# EasyEDA Pro project flexTouch_v2.eprj

# Schematic Schematic1
Board Name: Board1; Create Date: 2025-05-26; Page Name: P1; Project Name: flexTouch_v2; Schematic Name: Schematic1; Update Date: 2025-05-25; Company: EasyEDA.com; Page Size: A4; Version: V1.0
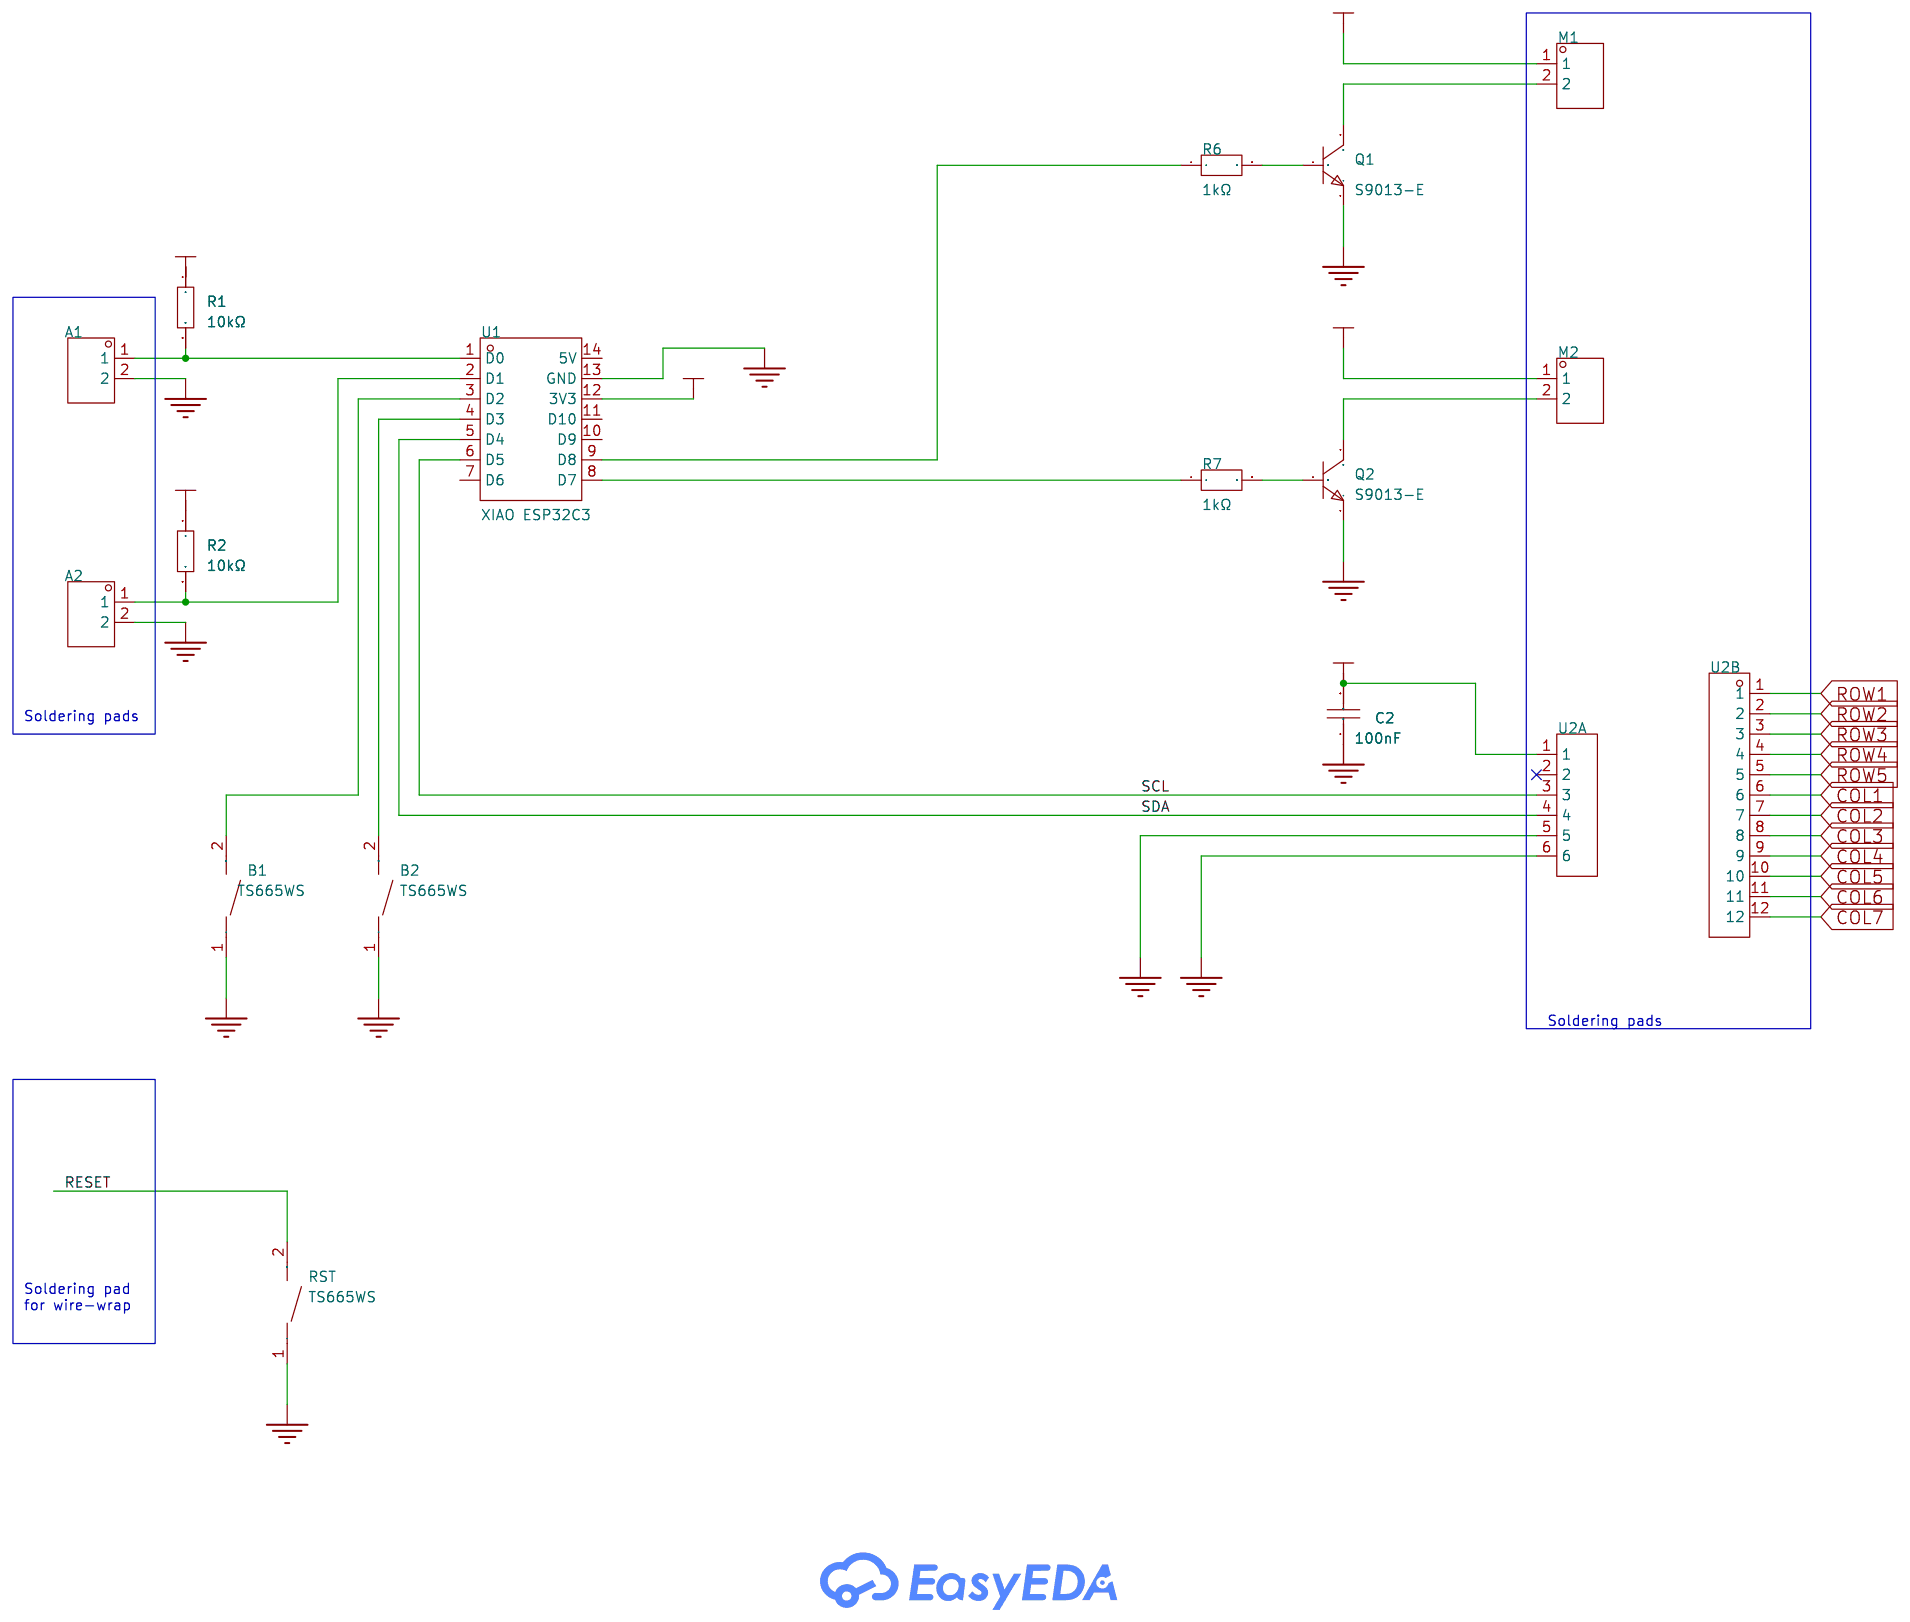
[diagram p0: schematic sheet]

## Parts
A1  B-2200S02P-A120  [HDR-TH_2P-P2.54-V-F]
A2  B-2200S02P-A120  [HDR-TH_2P-P2.54-V-F]
B1  TS665WS  [SW-SMD_L6.0-W6.0-LS6.6]
B2  TS665WS  [SW-SMD_L6.0-W6.0-LS6.6]
C2  100nF  [C0603]
M1  B-2200S02P-A120  [HDR-TH_2P-P2.54-V-F]
M2  B-2200S02P-A120  [HDR-TH_2P-P2.54-V-F]
Q1  S9013-E  [SOT-23-3_L2.9-W1.3-P1.90-LS2.4-BR]
Q2  S9013-E  [SOT-23-3_L2.9-W1.3-P1.90-LS2.4-BR]
R1  10kΩ  [R0603]
R2  10kΩ  [R0603]
R6  1kΩ  [R0603]
R7  1kΩ  [R0603]
RST  TS665WS  [SW-SMD_L6.0-W6.0-LS6.6]
U1  XIAO ESP32C3  [COMM-SMD_KQ-2801_V106]
U2A  2.54-1*6  [HDR-TH_6P-P2.54-V-M]
U2B  PM2.54-1*12  [HDR-TH_12P-P2.54-V-F]

## Library data of the parts
A1 A2 M1 M2 = B-2200S02P-A120: 插孔结构:1x2P;间距:2.54mm;行距:-;安装类型:直插;排数:单排;总孔位数:2P;塑高:-;触头材质:黄铜;触头镀层:-;; LCSC Part Name: 间距:2.54mm 1x2P 直插; Supplier Part: C124411; Manufacturer: Ckmtw(灿科盟); Supplier Footprint: 插件,P=2.54mm; JLCPCB Part Class: Extended Part; Datasheet: https://atta.szlcsc.com/upload/public/pdf/source/20170821/C124418_1503303326113901572.pdf; Supplier: LCSC; Holes Structure: 1x2P; Pitch: 2.54mm; Mounting Type: 直插; Number of Rows: 单排; Number of Holes: 2P; Contact Material: 黄铜
B1 B2 RST = TS665WS_C398058: Circuit:SPST Actuator Style:Round Button Operating Force:200gf Mounting Style:Brick nogging Switch Length:6mm Switch Width:6mm Switch Height:5mm Contact Current:50mA Voltage Rating (DC):12V With Lamp:- Mechanical Life:-; LCSC Part Name: 6*6*5mm 立贴 轻触开关; Supplier Part: C398058; Manufacturer: SHOU HAN(首韩); Supplier Footprint: SMD; JLCPCB Part Class: Extended Part; Datasheet: https://atta.szlcsc.com/upload/public/pdf/source/20190620/C398058_75EC11C2CCBC6DD113AE79D58CB25A40.pdf; Supplier: LCSC; Circuit: SPST; Actuator Style: Round Button; Operating Force: 200gf; Mounting Style: Brick nogging; Switch Length: 6mm; Switch Width: 6mm; Switch Height: 5mm; Contact Current: 50mA; Voltage Rating (DC): 12V
C2 = 0603B104K500NT_C30926: Capacitance:100nF Tolerance:±10% Tolerance:±10% Voltage Rating:50V Temperature Coefficient:X7R; LCSC Part Name: 100nF ±10% 50V; Supplier Part: C30926; Manufacturer: FH(风华); Manufacturer Part: 0603B104K500NT; Supplier Footprint: 0603; JLCPCB Part Class: Extended Part; Datasheet: https://atta.szlcsc.com/upload/public/pdf/source/20200305/C486355_26A10D38EF8C2A5C37091D0039909270.pdf; Supplier: LCSC; Tolerance: ±10%; Voltage Rating: 50V; Temperature Coefficient: X7R
Q1 Q2 = S9013-E: 晶体管类型:NPN;集电极电流(Ic):500mA;集射极击穿电压(Vceo):25V;耗散功率(Pd):300mW;直流电流增益(hFE):120@50mA,1V;; Supplier Part: C41371419; Manufacturer: MDD(辰达半导体); Supplier Footprint: SOT-23; JLCPCB Part Class: Extended Part; Datasheet: https://atta.szlcsc.com/upload/public/pdf/source/20241113/4DDBD2B8A7B6A974495B9B970C95E559.pdf; Supplier: LCSC; type: NPN; Current - Collector(Ic): 500mA; Collector - Emitter Voltage VCEO: 25V; Pd - Power Dissipation: 300mW; DC Current Gain: 120@50mA,1V; Transition frequency(fT): 150MHz; Current - Collector Cutoff: 100nA; Vce Saturation(VCE(sat)): 600mV; Operating Temperature: -55℃~+150℃
R1 R2 = RC0603FR-0710KL: Type:Thick Film Resistors Resistance: Tolerance:±1% Tolerance:±1% Power(Watts): Overload Voltage (Max): Temperature Coefficient:±100ppm/℃ Temperature Coefficient:±100ppm/℃ Operating Temperature Range:-55℃~+155℃ Operating Temperature Range:-55℃~+155℃; LCSC Part Name: 厚膜电阻 10kΩ ±1% 100mW; Supplier Part: C98220; Manufacturer: YAGEO(国巨); Supplier Footprint: 0603; JLCPCB Part Class: Extended Part; Datasheet: https://atta.szlcsc.com/upload/public/pdf/source/20180927/C295883_E8D83085EA81BD7DE0B2B681138C15EE.pdf; Supplier: LCSC; Type: Thick Film Resistors; Tolerance: ±1%; Temperature Coefficient: ±100ppm/℃; Operating Temperature Range: -55℃~+155℃
R6 R7 = SCR0603J1K: 电阻类型:厚膜电阻;阻值:1kΩ;精度:±5%;功率:100mW;最大工作电压:75V;; LCSC Part Name: 厚膜电阻 1kΩ ±5% 100mW; Supplier Part: C3017736; Manufacturer: VO(翔胜); Supplier Footprint: 0603; JLCPCB Part Class: Extended Part; Datasheet: https://atta.szlcsc.com/upload/public/pdf/source/20220513/247AF9639BA21CF93567DC289CCC6A22.pdf; Supplier: LCSC; Type: 厚膜电阻; Tolerance: ±5%; Power(Watts): 100mW; Overload Voltage (Max): 75V; Operating Temperature Range: -55℃~+155℃
U1 = XIAO ESP32C3: Supplier Part: C19189385; Supplier Footprint: QFN-32_5X5_EP3.7; JLCPCB Part Class: Extended Part; Supplier: LCSC
U2A = 2.54-1*6: Supplier Part: C5156615; Manufacturer: ZHOURI(洲日); Supplier Footprint: 插件,P=2.54mm; JLCPCB Part Class: Extended Part; Datasheet: https://atta.szlcsc.com/upload/public/pdf/source/20250227/F941FC765EF241ABFB2D5D72948A31A5.pdf; Supplier: LCSC; Pin Structure: 1x6P; Pitch: 2.54mm; Number of Rows: Single Row; Number of Pins: 6P
U2B = PM2.54-1*12: LCSC Part Name: 间距:2.54mm 1x12P 直插; Supplier Part: C5224029; Manufacturer: ZHOURI(洲日); Supplier Footprint: 插件,P=2.54mm; JLCPCB Part Class: Extended Part; Datasheet: https://atta.szlcsc.com/upload/public/pdf/source/20221031/8E1EDE7098C69E0E34EB4CABE01AB99F.pdf; Supplier: LCSC; Holes Structure: 1x12P; Pitch: 2.54mm; Row Spacing: 2.54mm; Circular Hole / Square Hole: 方孔; Mounting Type: Straight; Number of Rows: Plugin; Number of Holes: 12P; Current Rating (Max): 2.5A; Holes Direction: Top; Insulation Height: 8.5mm; Operating Temperature Range: -40℃~+105℃

## Nets
3V3: C2.2 M1.1 M2.1 R1.1 R2.1 U1.12(3V3) U2A.1
GND: A1.2 A2.2 B1.1(A) B2.1(A) C2.1 Q1.2(E) Q2.2(E) RST.1(A) U1.13(GND) U2A.5 U2A.6
COL1: U2B.6
COL2: U2B.7
COL3: U2B.8
COL4: U2B.9
COL5: U2B.10
COL6: U2B.11
COL7: U2B.12
RESET: RST.2(B)
ROW1: U2B.1
ROW2: U2B.2
ROW3: U2B.3
ROW4: U2B.4
ROW5: U2B.5
SCL: U1.6(D5) U2A.3
SDA: U1.5(D4) U2A.4
$1N1297: M1.2 Q1.3(C)
$1N1300: Q1.1(B) R6.2
$1N1301: R6.1 U1.9(D8)
$1N1303: M2.2 Q2.3(C)
$1N1306: Q2.1(B) R7.2
$1N1307: R7.1 U1.8(D7)
$1N1322: A1.1 R1.2 U1.1(D0)
$1N1324: A2.1 R2.2 U1.2(D1)
$1N1326: B1.2(B) U1.3(D2)
$1N1327: B2.2(B) U1.4(D3)

Not connected (* = marked no-connect by the designer): U1 7(D6) 10(D9) 11(D10) 14(5V); U2A 2*

## Notes on the sheet
- Soldering pads
- Soldering pads
- Soldering pad
  for wire-wrap

# Board PCB1
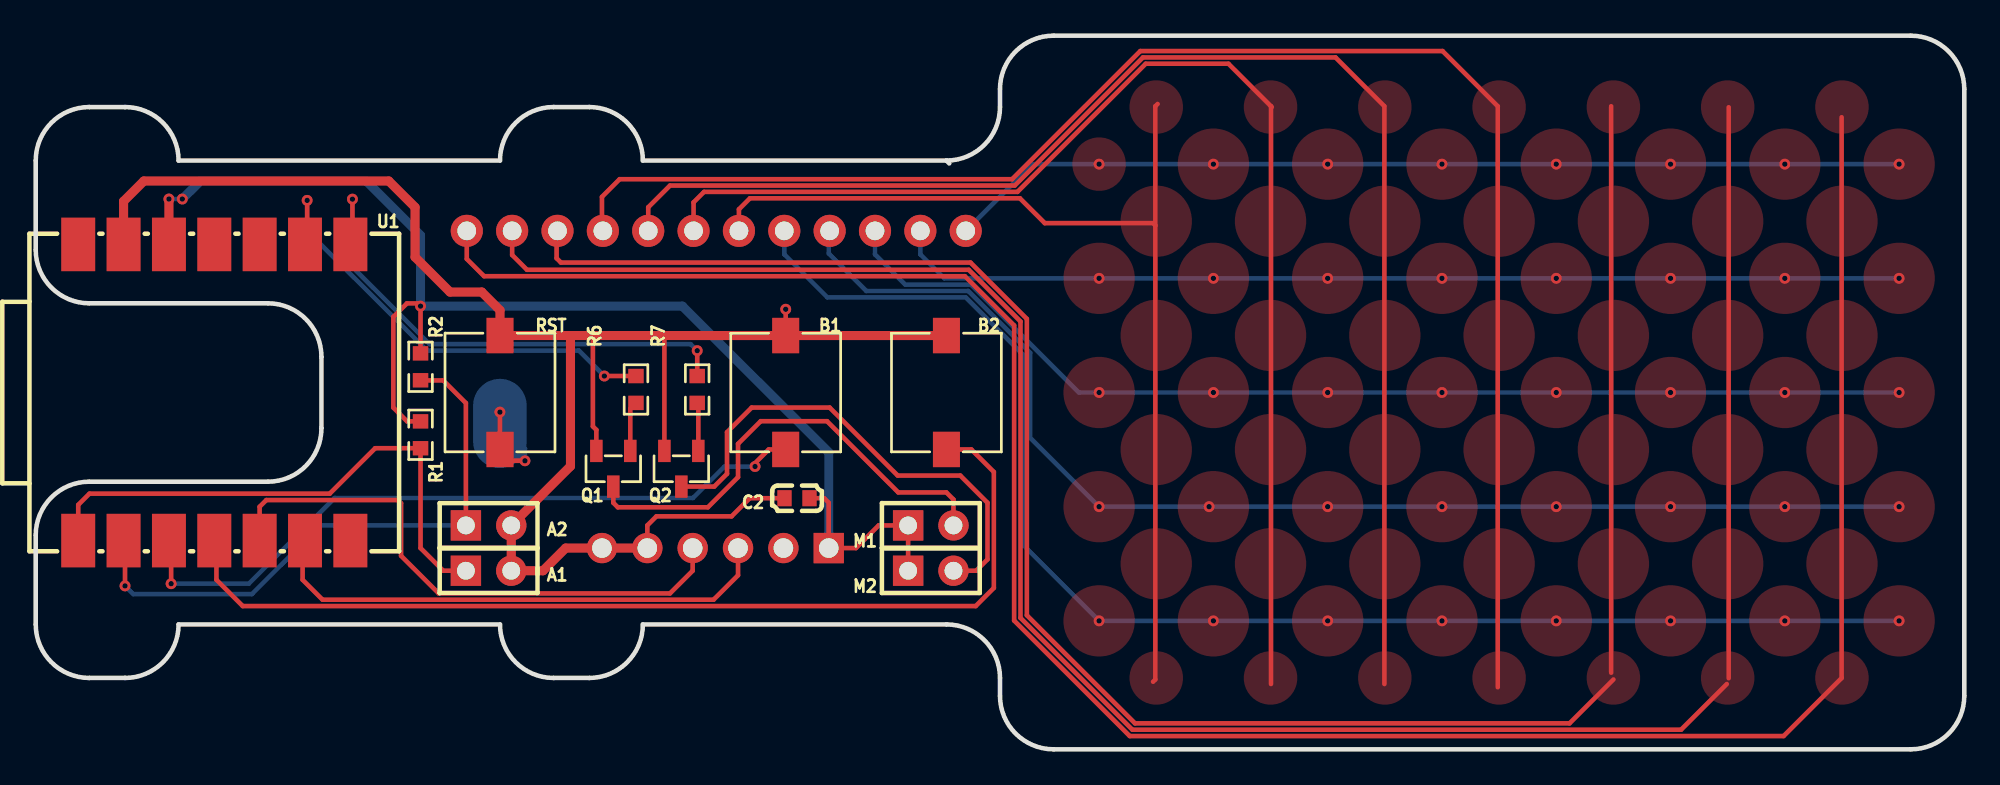
[diagram p1: board, top side]
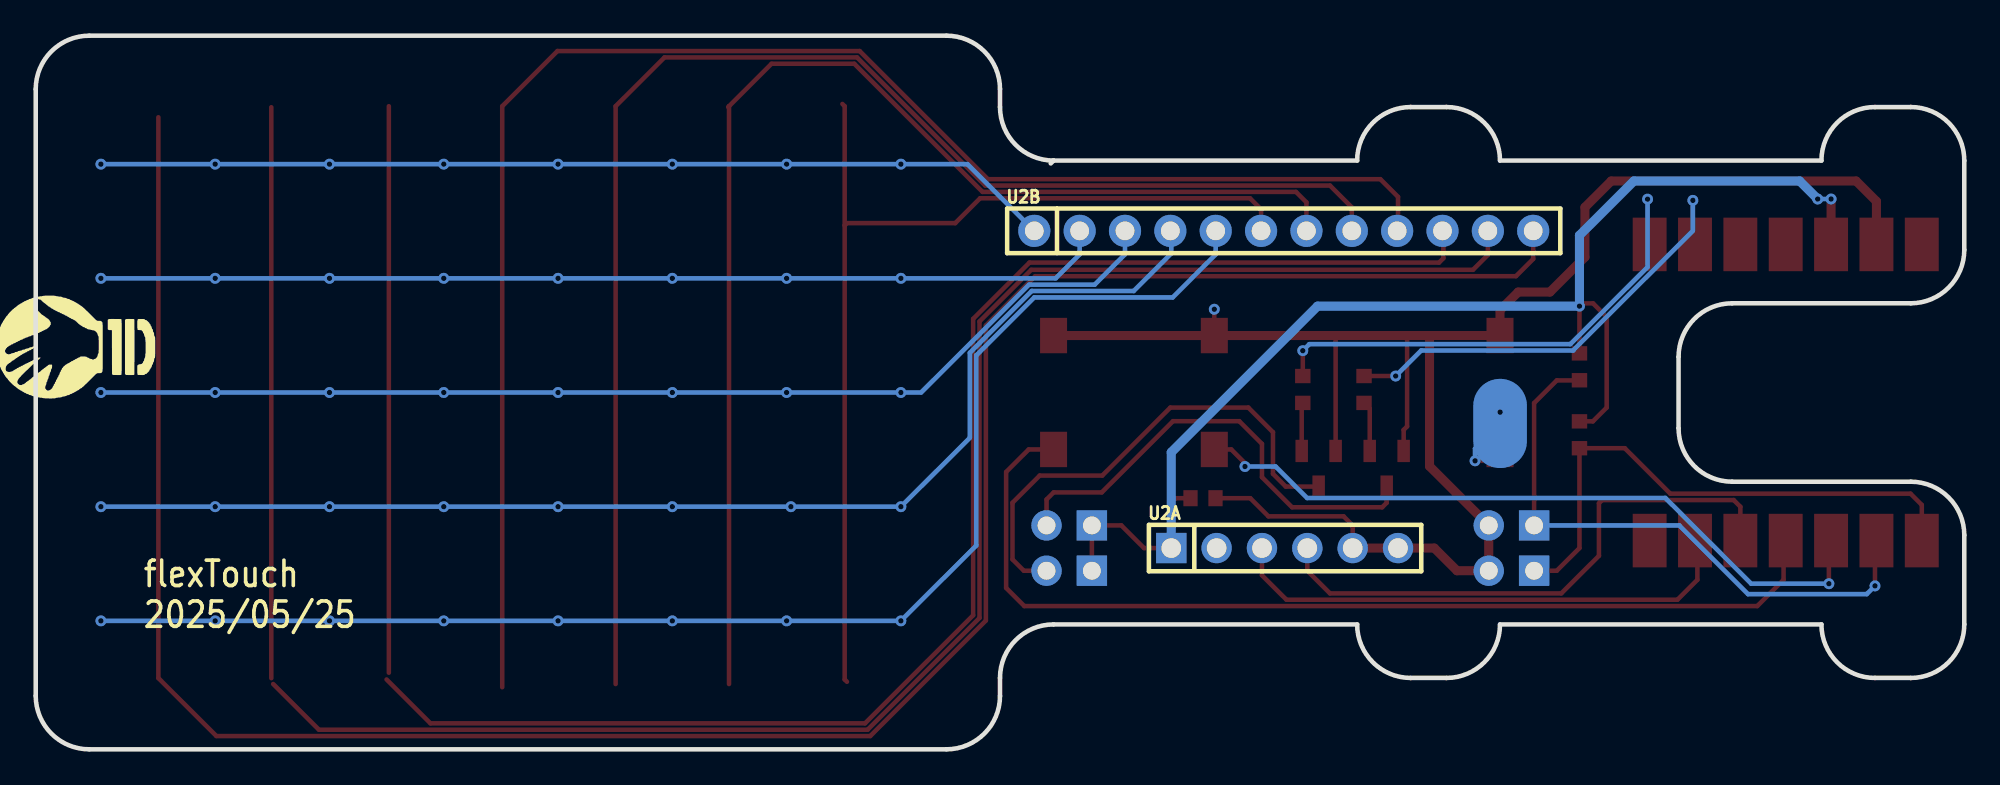
[diagram p2: board, bottom side, seen from below]

Outline 108 x 40 mm; copper layers: Top Layer, Bottom Layer. Coordinates in mm from the lower left corner of the outline.
Outline path: 51,33 34,33 arc(33.12,35.12) 31,36 29,36 arc(26.88,35.12) 26,33 8,33 arc(7.12,35.12) 5,36 3,36 arc(0.88,35.12) 0,33 0,28 arc(0.88,25.88) 3,25 13,25 arc(15.12,24.12) 16,22 16,18 arc(15.12,15.88) 13,15 3,15 arc(0.88,14.12) 0,12 0,7 arc(0.88,4.88) 3,4 5,4 arc(7.12,4.88) 8,7 26,7 arc(26.88,4.88) 29,4 31,4 arc(33.12,4.88) 34,7 51,7 arc(53.12,6.12) 54,4 54,3 arc(54.88,0.88) 57,0 105,0 arc(107.12,0.88) 108,3 108,37 arc(107.12,39.12) 105,40 57,40 arc(54.88,39.12) 54,37 54,36 arc(53.12,33.88) 51,33 ; 51,33 51.16,32.84
Stack: Top Layer 0.035mm / Dielectric1 1.51mm FR4 er 4.5 / Bottom Layer 0.035mm

## Design rules (mm)
template: JLCPCB Capability(Two Layers Board)
spacing copperThickness1oz (default): track to track 0.102, other pairs 0.152 to 0.3
spacing copperThickness2oz: track to track 0.203, other pairs 0.152 to 0.3
track width copperThickness1oz (default): min 0.127, default 0.254, max 2.54
track width copperThickness2oz: min 0.203, default 0.254, max 2.54
differential pair differentialPair (default): width min 0.127, default 0.254, max 2.54; gap min 0.152, default 0.152
via viaSize (default): diameter min 0.5, default 0.61, max 10; hole min 0.3, default 0.305, max 6.3

## Placement (name value [footprint] x y rotation side)
A1  B-2200S02P-A120  [HDR-TH_2P-P2.54-V-F]  25.36 10.01 0 top
A2  B-2200S02P-A120  [HDR-TH_2P-P2.54-V-F]  25.36 12.55 0 top
B1  TS665WS  [SW-SMD_L6.0-W6.0-LS6.6]  42 20 270 top
B2  TS665WS  [SW-SMD_L6.0-W6.0-LS6.6]  51 20 270 top
C2  100nF  [C0603]  42.63 14.07 0 top
M1  B-2200S02P-A120  [HDR-TH_2P-P2.54-V-F]  50.12 12.55 0 top
M2  B-2200S02P-A120  [HDR-TH_2P-P2.54-V-F]  50.12 10.01 0 top
NOREF  -  [Pad_e752]  26 18.27 0 top
Q1  S9013-E  [SOT-23-3_L2.9-W1.3-P1.90-LS2.4-BR]  32.34 15.72 90 top
Q2  S9013-E  [SOT-23-3_L2.9-W1.3-P1.90-LS2.4-BR]  36.16 15.72 90 top
R1  10kΩ  [R0603]  21.55 17.63 270 top
R2  10kΩ  [R0603]  21.55 21.44 270 top
R6  1kΩ  [R0603]  33.61 20.17 270 top
R7  1kΩ  [R0603]  37.04 20.17 270 top
RST  TS665WS  [SW-SMD_L6.0-W6.0-LS6.6]  26 20 270 top
U1  XIAO ESP32C3  [COMM-SMD_KQ-2801_V106]  10 20 0 top
U2A  2.54-1*6  [HDR-TH_6P-P2.54-V-M]  38.06 11.28 180 bottom
U2B  PM2.54-1*12  [HDR-TH_12P-P2.54-V-F]  38.11 29.06 180 bottom

## Footprints (pads in the part's own frame, mm; a bottom-side part is the same pattern mirrored in y, then rotated)
C0603
  rect 0.8x0.9 smd: 1(-0.7,0) 2(0.7,0)
COMM-SMD_KQ-2801_V106
  rect 1.9x3 smd: 1(-7.62,-8.3) 2(-5.08,-8.3) 3(-2.54,-8.3) 4(0,-8.3) 5(2.54,-8.3) 6(5.08,-8.3) 7(7.62,-8.3) 8(7.62,8.3) 9(5.08,8.3) 10(2.54,8.3) 11(0,8.3) 12(-2.54,8.3) 13(-5.08,8.3) 14(-7.62,8.3)
HDR-TH_2P-P2.54-V-F
  rect 1.7x1.7 hole 1: 1(-1.27,0)
  round 1.7 hole 1: 2(1.27,0)
HDR-TH_6P-P2.54-V-M
  rect 1.7x1.7 hole 1.1: 1(-6.35,0)
  round 1.7 hole 1.1: 2(-3.81,0) 3(-1.27,0) 4(1.27,0) 5(3.81,0) 6(6.35,0)
HDR-TH_12P-P2.54-V-F
  round 1.8 hole 1.05: 1(-13.97,0) 2(-11.43,0) 3(-8.89,0) 4(-6.35,0) 5(-3.81,0) 6(-1.27,0) 7(1.27,0) 8(3.81,0) 9(6.35,0) 10(8.89,0) 11(11.43,0) 12(13.97,0)
Pad_e752
  oval 3x5 smd far side: 1(0,0)
R0603
  rect 0.806x0.864 smd: 1(-0.753,0) 2(0.753,0)
SOT-23-3_L2.9-W1.3-P1.90-LS2.4-BR
  rect 1.25x0.7 smd: 1(1,-0.95) 2(1,0.95) 3(-1,0)
SW-SMD_L6.0-W6.0-LS6.6
  rect 1.985x1.512 smd: 1(-3.192,0) 2(3.192,0)

## Nets
As in the schematic, except:
RESET: NOREF.1 RST.2

Pads without a net: U1 7 10 11 14; U2A 2

## Via types
v1: diameter 0.61, hole 0.305, Top Layer to Bottom Layer, 53 vias

## Routing (per net, layer and track width the routed paths; a pad name or vN(x,y) marks a point on that pad's centre or on a via; arc(x,y) is an arc through that point)
3V3: length 76.6
  Top Layer w0.254: R1.1 20.8,18.38 20.03,19.15 20.03,24.23 20.79,25 21.4,25 v1(21.55,24.84) R2.1 ; M2.1 M1.1 47.2,12.55 45.93,11.28 U2A.1 44.41,13.82 44.16,14.07 C2.2
  Top Layer w0.508: U1.12 v1(7.46,30.84)
  Bottom Layer w0.254: v1(8.21,30.84) v1(7.46,30.84)
  Bottom Layer w0.508: v1(8.21,30.84) 9.22,31.85 18.5,31.85 21.55,28.81 v1(21.55,24.84) 36.21,24.84 44.41,16.64 U2A.1
GND: length 101.8
  Top Layer w0.254: 31.2,23.19 31.2,18.1 31.39,17.91 Q1.2 ; Q2.2 35.2,23.19 ; v1(42,24.67) B1.1 ; C2.1 39.98,14.07 38.97,13.06 34.76,13.06 34.25,12.55 U2A.5
  Top Layer w0.508: U1.13 4.92,30.72 6.06,31.85 19.77,31.85 21.24,30.38 21.24,27.59 23.2,25.63 24.98,25.63 26,24.61 RST.1 29.95,23.19 ; U2A.5 U2A.6 29.68,11.28 28.41,10.01 A1.2 A2.2 29.95,15.87 29.95,23.19 ; 29.95,23.19 B1.1 B2.1
COL1: length 57.9
  Top Layer w0.254: U2B.6 39.38,30.27 40,30.89 55.11,30.89 56.51,29.49 62.57,29.49 62.7,29.36 ; 62.7,29.36 62.7,3.91 62.57,3.79 ; 62.7,29.36 62.7,36.05 62.82,36.17
COL2: length 70.6
  Top Layer w0.254: 69.18,36.05 66.79,38.43 62.16,38.43 54.98,31.24 37.43,31.24 36.84,30.66 U2B.7 ; 69.18,36.05 69.22,36 ; 69.18,36.05 69.18,3.66
COL3: length 79.5
  Top Layer w0.254: U2B.8 34.3,30.38 35.52,31.6 54.82,31.6 62.01,38.78 72.79,38.78 75.53,36.05 75.53,3.66
COL4: length 89.3
  Top Layer w0.254: 81.88,3.48 81.88,36.05 78.78,39.14 61.86,39.14 54.68,31.96 32.7,31.96 31.71,30.97 31.71,29.11 U2B.9
COL5: length 114
  Top Layer w0.254: U2B.10 29.17,29.01 29.17,27.53 29.41,27.28 52.35,27.28 55.5,24.13 55.5,7.51 61.56,1.46 85.89,1.46 88.35,3.91 ; 88.22,36.05 88.22,4.3
COL6: length 123.2
  Top Layer w0.254: 94.81,35.99 94.81,3.99 ; U2B.11 26.68,27.71 27.51,26.88 52.25,26.88 55.15,23.98 55.15,7.36 61.41,1.1 92.14,1.1 94.7,3.66
COL7: length 132.1
  Top Layer w0.254: 101.13,35.43 101.13,3.99 97.88,0.74 61.27,0.74 54.79,7.22 54.79,23.76 52.03,26.52 25.11,26.52 24.14,27.49 U2B.12
RESET: length 6.4
  Top Layer w0.254: v1(27.4,16.17) 26.64,16.17 RST.2 26,16.81 v1(26,18.9)
  Bottom Layer w0.254: NOREF.1 27.4,16.86 v1(27.4,16.17)
ROW1: length 53.8
  Bottom Layer w0.254: v1(104.35,32.8) v1(97.95,32.8) v1(91.55,32.8) v1(85.15,32.8) v1(78.75,32.8) v1(72.35,32.8) v1(65.95,32.8) v1(59.55,32.8) 55.82,32.8 U2B.1
ROW2: length 56.7
  Bottom Layer w0.254: U2B.2 49.54,27.74 50.88,26.4 v1(59.55,26.4) v1(65.95,26.4) v1(72.35,26.4) v1(78.75,26.4) v1(85.15,26.4) v1(91.55,26.4) v1(97.95,26.4) v1(104.35,26.4)
ROW3: length 61.9
  Bottom Layer w0.254: U2B.3 47,27.74 48.7,26.04 52.37,26.04 58.42,20 v1(59.55,20) v1(65.95,20) v1(72.35,20) v1(78.75,20) v1(85.15,20) v1(91.55,20) v1(97.95,20) v1(104.35,20)
ROW4: length 69.9
  Bottom Layer w0.254: v1(104.35,13.6) v1(97.95,13.6) v1(91.55,13.6) v1(85.15,13.6) v1(78.75,13.6) v1(72.35,13.6) v1(65.71,13.6) v1(59.55,13.6) 55.69,17.46 55.69,22.23 52.23,25.69 46.51,25.69 44.41,27.79 44.41,29.01 U2B.4
ROW5: length 78.5
  Bottom Layer w0.254: U2B.5 41.92,27.74 44.33,25.33 52.08,25.33 55.33,22.08 55.33,11.42 v1(59.55,7.2) v1(65.95,7.2) v1(72.35,7.2) v1(78.75,7.2) v1(85.15,7.2) v1(91.55,7.2) v1(97.95,7.2) v1(104.35,7.2)
SCL: length 29.2
  Top Layer w0.254: U2A.3 39.33,9.76 37.96,8.38 16.06,8.38 14.95,9.5 14.95,11.57 U1.6
SDA: length 32
  Top Layer w0.254: U2A.4 36.79,10.01 35.52,8.74 22.57,8.74 20.46,10.85 20.46,13.79 20.28,13.97 12.91,13.97 12.54,13.6 U1.5
$1N1297: length 26.4
  Top Layer w0.254: M1.2 51.4,14 50.99,14.4 48.3,14.4 44.31,18.39 40.6,18.39 39.33,17.12 39.33,15.25 37.64,13.57 32.6,13.57 32.34,13.82 Q1.3
$1N1300: length 2.8
  Top Layer w0.254: R6.2 33.3,19.1 Q1.1
$1N1301: length 26
  Top Layer w0.254: U1.9 15.2,28.42 v1(15.2,30.77) ; v1(31.84,20.92) R6.1
  Bottom Layer w0.254: v1(15.2,30.77) 15.2,29.06 21.91,22.35 30.41,22.35 v1(31.84,20.92)
$1N1303: length 27.9
  Top Layer w0.254: Q2.3 38,14.72 38.71,15.44 38.71,17.78 40.09,19.15 44.46,19.15 48.27,15.34 51.78,15.34 53.3,13.82 53.3,10.64 52.66,10.01 M2.2
$1N1306: length 2.8
  Top Layer w0.254: Q2.1 37.1,19.1 36.79,19.42
$1N1307: length 28.8
  Top Layer w0.254: U1.8 17.74,28.42 v1(17.74,30.84) ; 37.04,21.18 v1(37.04,22.34)
  Bottom Layer w0.254: v1(37.04,22.34) 36.68,22.71 22.06,22.71 17.74,27.03 v1(17.74,30.84)
$1N1322: length 31.1
  Top Layer w0.254: A1.1 22.82,10.01 21.55,11.28 R1.2 19.01,16.88 16.46,14.33 3.01,14.33 2.38,13.7 U1.1
$1N1324: length 34.5
  Top Layer w0.254: v1(5,9.16) 5,12.17 4.92,12.25 U1.2 ; A2.1 24.09,19.41 22.82,20.68 21.56,20.68 R2.2
  Bottom Layer w0.254: v1(5,9.16) 5.46,8.7 12.11,8.7 15.96,12.55 A2.1
$1N1326: length 41.1
  Top Layer w0.254: B1.2 41.05,16.81 40.28,16.04 v1(40.28,15.85) ; v1(7.58,9.28) 7.58,12.08 7.46,12.2 U1.3
  Bottom Layer w0.254: v1(7.58,9.28) 11.93,9.28 16.74,14.09 36.8,14.09 38.57,15.85 v1(40.28,15.85)
$1N1327: length 56.6
  Top Layer w0.254: U1.4 10.12,11.58 10.12,9.5 11.59,8.03 52.64,8.03 53.66,9.05 53.66,15.55 52.39,16.81 B2.2 50.85,16.81

## Copper pours and planes (outline as drawn; the poured copper is in the pictures)
COL1 on Top Layer: 61.25,5.5 64.25,5.5 64.25,2.5 61.25,2.5
COL1 on Top Layer: 60.75,31.6 64.75,31.6 64.75,27.6 60.75,27.6
COL1 on Top Layer: 60.75,18.8 64.75,18.8 64.75,14.8 60.75,14.8
COL1 on Top Layer: 60.75,12.4 64.75,12.4 64.75,8.4 60.75,8.4
COL1 on Top Layer: 60.75,25.2 64.75,25.2 64.75,21.2 60.75,21.2
COL1 on Top Layer: 61.25,37.5 64.25,37.5 64.25,34.5 61.25,34.5
COL2 on Top Layer: 67.15,25.2 71.15,25.2 71.15,21.2 67.15,21.2
COL2 on Top Layer: 67.65,37.5 70.65,37.5 70.65,34.5 67.65,34.5
COL2 on Top Layer: 67.15,12.4 71.15,12.4 71.15,8.4 67.15,8.4
COL2 on Top Layer: 67.15,18.8 71.15,18.8 71.15,14.8 67.15,14.8
COL2 on Top Layer: 67.65,5.5 70.65,5.5 70.65,2.5 67.65,2.5
COL2 on Top Layer: 67.15,31.6 71.15,31.6 71.15,27.6 67.15,27.6
COL3 on Top Layer: 73.55,31.6 77.55,31.6 77.55,27.6 73.55,27.6
COL3 on Top Layer: 73.55,12.4 77.55,12.4 77.55,8.4 73.55,8.4
COL3 on Top Layer: 73.55,25.2 77.55,25.2 77.55,21.2 73.55,21.2
COL3 on Top Layer: 73.55,18.8 77.55,18.8 77.55,14.8 73.55,14.8
COL3 on Top Layer: 74.05,37.5 77.05,37.5 77.05,34.5 74.05,34.5
COL3 on Top Layer: 74.05,5.5 77.05,5.5 77.05,2.5 74.05,2.5
COL4 on Top Layer: 80.45,37.5 83.45,37.5 83.45,34.5 80.45,34.5
COL4 on Top Layer: 79.95,25.2 83.95,25.2 83.95,21.2 79.95,21.2
COL4 on Top Layer: 79.95,31.6 83.95,31.6 83.95,27.6 79.95,27.6
COL4 on Top Layer: 79.95,18.8 83.95,18.8 83.95,14.8 79.95,14.8
COL4 on Top Layer: 80.45,5.5 83.45,5.5 83.45,2.5 80.45,2.5
COL4 on Top Layer: 79.95,12.4 83.95,12.4 83.95,8.4 79.95,8.4
COL5 on Top Layer: 86.35,31.6 90.35,31.6 90.35,27.6 86.35,27.6
COL5 on Top Layer: 86.35,12.4 90.35,12.4 90.35,8.4 86.35,8.4
COL5 on Top Layer: 86.35,25.2 90.35,25.2 90.35,21.2 86.35,21.2
COL5 on Top Layer: 86.85,5.5 89.85,5.5 89.85,2.5 86.85,2.5
COL5 on Top Layer: 86.85,37.5 89.85,37.5 89.85,34.5 86.85,34.5
COL5 on Top Layer: 86.35,18.8 90.35,18.8 90.35,14.8 86.35,14.8
COL6 on Top Layer: 92.75,31.6 96.75,31.6 96.75,27.6 92.75,27.6
COL6 on Top Layer: 92.75,18.8 96.75,18.8 96.75,14.8 92.75,14.8
COL6 on Top Layer: 92.75,25.2 96.75,25.2 96.75,21.2 92.75,21.2
COL6 on Top Layer: 93.25,37.5 96.25,37.5 96.25,34.5 93.25,34.5
COL6 on Top Layer: 92.75,12.4 96.75,12.4 96.75,8.4 92.75,8.4
COL6 on Top Layer: 93.25,5.5 96.25,5.5 96.25,2.5 93.25,2.5
COL7 on Top Layer: 99.65,37.5 102.65,37.5 102.65,34.5 99.65,34.5
COL7 on Top Layer: 99.15,12.4 103.15,12.4 103.15,8.4 99.15,8.4
COL7 on Top Layer: 99.15,31.6 103.15,31.6 103.15,27.6 99.15,27.6
COL7 on Top Layer: 99.65,5.5 102.65,5.5 102.65,2.5 99.65,2.5
COL7 on Top Layer: 99.15,18.8 103.15,18.8 103.15,14.8 99.15,14.8
COL7 on Top Layer: 99.15,25.2 103.15,25.2 103.15,21.2 99.15,21.2
ROW1 on Top Layer: 58.05,34.3 61.05,34.3 61.05,31.3 58.05,31.3
ROW1 on Top Layer: 102.35,34.8 106.35,34.8 106.35,30.8 102.35,30.8
ROW1 on Top Layer: 63.95,34.8 67.95,34.8 67.95,30.8 63.95,30.8
ROW1 on Top Layer: 70.35,34.8 74.35,34.8 74.35,30.8 70.35,30.8
ROW1 on Top Layer: 76.75,34.8 80.75,34.8 80.75,30.8 76.75,30.8
ROW1 on Top Layer: 89.55,34.8 93.55,34.8 93.55,30.8 89.55,30.8
ROW1 on Top Layer: 95.95,34.8 99.95,34.8 99.95,30.8 95.95,30.8
ROW1 on Top Layer: 83.15,34.8 87.15,34.8 87.15,30.8 83.15,30.8
ROW2 on Top Layer: 102.35,28.4 106.35,28.4 106.35,24.4 102.35,24.4
ROW2 on Top Layer: 57.55,28.4 61.55,28.4 61.55,24.4 57.55,24.4
ROW2 on Top Layer: 83.15,28.4 87.15,28.4 87.15,24.4 83.15,24.4
ROW2 on Top Layer: 70.35,28.4 74.35,28.4 74.35,24.4 70.35,24.4
ROW2 on Top Layer: 95.95,28.4 99.95,28.4 99.95,24.4 95.95,24.4
ROW2 on Top Layer: 89.55,28.4 93.55,28.4 93.55,24.4 89.55,24.4
ROW2 on Top Layer: 76.75,28.4 80.75,28.4 80.75,24.4 76.75,24.4
ROW2 on Top Layer: 63.95,28.4 67.95,28.4 67.95,24.4 63.95,24.4
ROW3 on Top Layer: 57.55,22 61.55,22 61.55,18 57.55,18
ROW3 on Top Layer: 89.55,22 93.55,22 93.55,18 89.55,18
ROW3 on Top Layer: 102.35,22 106.35,22 106.35,18 102.35,18
ROW3 on Top Layer: 83.15,22 87.15,22 87.15,18 83.15,18
ROW3 on Top Layer: 70.35,22 74.35,22 74.35,18 70.35,18
ROW3 on Top Layer: 63.95,22 67.95,22 67.95,18 63.95,18
ROW3 on Top Layer: 76.75,22 80.75,22 80.75,18 76.75,18
ROW3 on Top Layer: 95.95,22 99.95,22 99.95,18 95.95,18
ROW4 on Top Layer: 57.55,15.6 61.55,15.6 61.55,11.6 57.55,11.6
ROW4 on Top Layer: 63.95,15.6 67.95,15.6 67.95,11.6 63.95,11.6
ROW4 on Top Layer: 89.55,15.6 93.55,15.6 93.55,11.6 89.55,11.6
ROW4 on Top Layer: 70.35,15.6 74.35,15.6 74.35,11.6 70.35,11.6
ROW4 on Top Layer: 95.95,15.6 99.95,15.6 99.95,11.6 95.95,11.6
ROW4 on Top Layer: 76.75,15.6 80.75,15.6 80.75,11.6 76.75,11.6
ROW4 on Top Layer: 83.15,15.6 87.15,15.6 87.15,11.6 83.15,11.6
ROW4 on Top Layer: 102.35,15.6 106.35,15.6 106.35,11.6 102.35,11.6
ROW5 on Top Layer: 83.15,9.2 87.15,9.2 87.15,5.2 83.15,5.2
ROW5 on Top Layer: 63.95,9.2 67.95,9.2 67.95,5.2 63.95,5.2
ROW5 on Top Layer: 57.55,9.2 61.55,9.2 61.55,5.2 57.55,5.2
ROW5 on Top Layer: 95.95,9.2 99.95,9.2 99.95,5.2 95.95,5.2
ROW5 on Top Layer: 102.35,9.2 106.35,9.2 106.35,5.2 102.35,5.2
ROW5 on Top Layer: 70.35,9.2 74.35,9.2 74.35,5.2 70.35,5.2
ROW5 on Top Layer: 76.75,9.2 80.75,9.2 80.75,5.2 76.75,5.2
ROW5 on Top Layer: 89.55,9.2 93.55,9.2 93.55,5.2 89.55,5.2

## Text on the board
Bottom Silkscreen Layer: flexTouch / 2025/05/25
